# Altium schematic sheet secon_analog_in.SchDoc: foxBMS BMS-Slave 12-Cell
size A3; DocumentNumber: 10; SheetNumber: 10; SheetTotal: 19; AUTHOR: Fraunhofer IISB foxBMS Team; SheetDescription: Secondary Analog Inputs
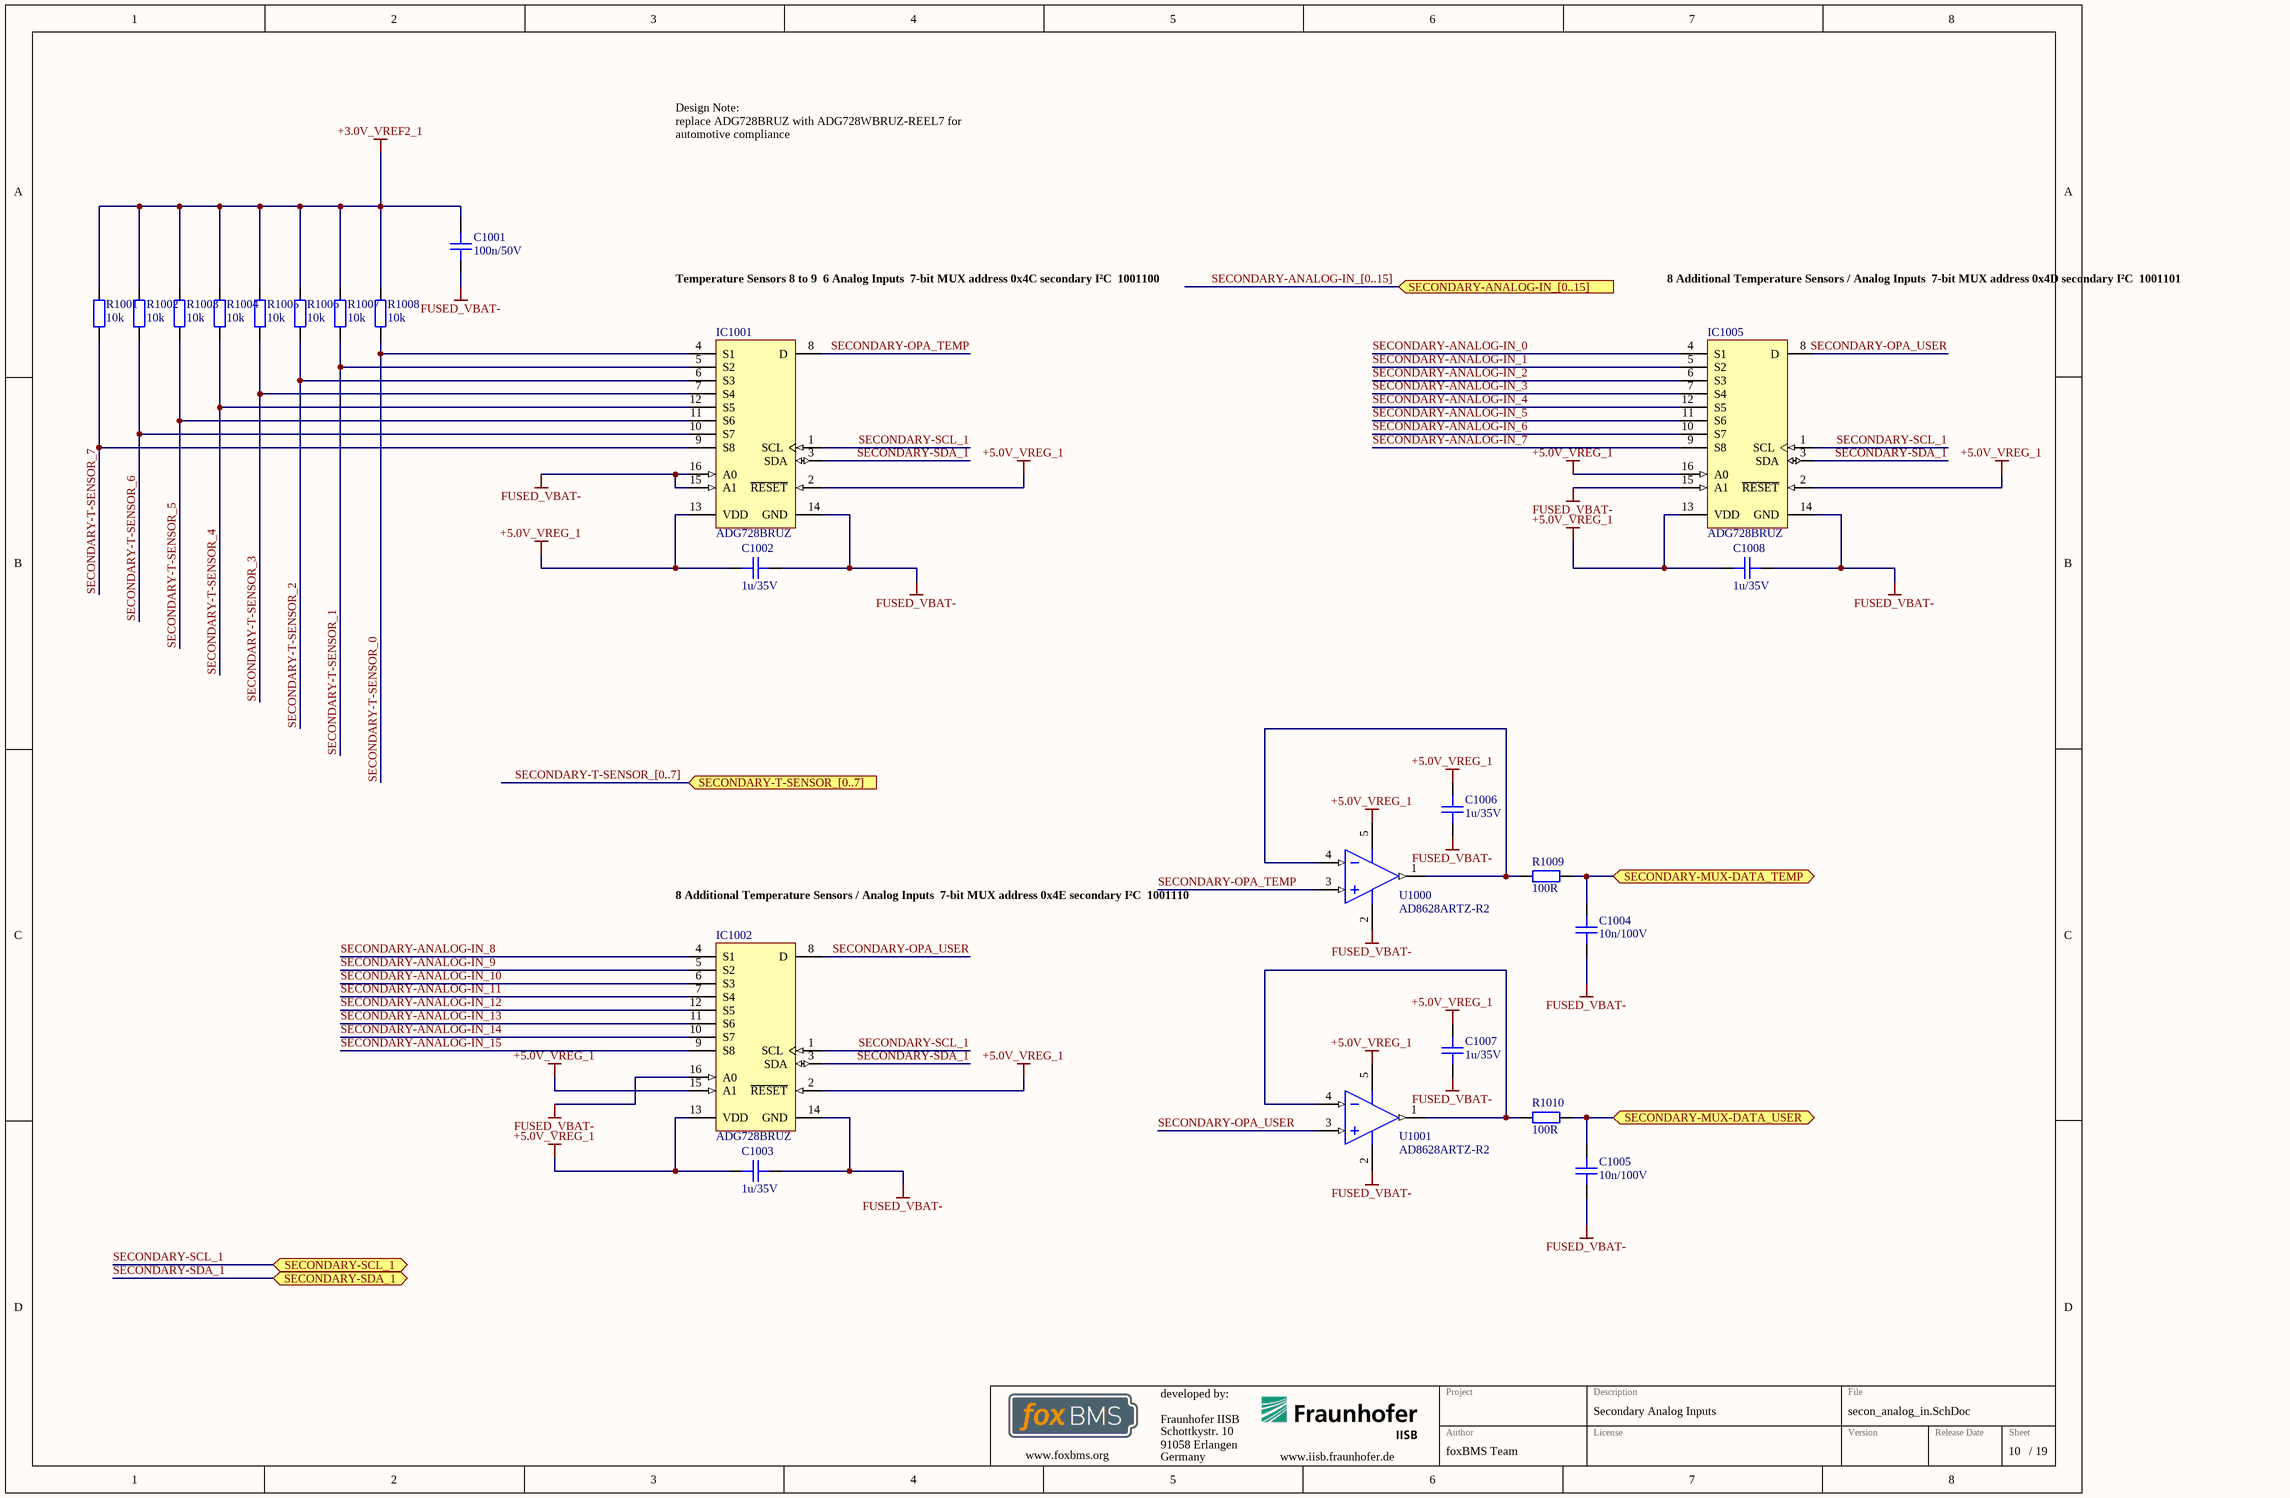
[diagram p0: secon_analog_in.SchDoc]

## Parts
C1001  100n/50V  [CAPC1608X08N]
C1002  1u/35V  [CAPC1608X08N]
C1003  1u/35V  [CAPC1608X08N]
C1004  10n/100V  [CAPC1608X08N]
C1005  10n/100V  [CAPC1608X08N]
C1006  1u/35V  [CAPC1608X08N]
C1007  1u/35V  [CAPC1608X08N]
C1008  1u/35V  [CAPC1608X08N]
IC1001  ADG728BRUZ  [ADI-RU-16_M]
IC1002  ADG728BRUZ  [ADI-RU-16_M]
IC1005  ADG728BRUZ  [ADI-RU-16_M]
R1001  10k  [RESC1608X05N]
R1002  10k  [RESC1608X05N]
R1003  10k  [RESC1608X05N]
R1004  10k  [RESC1608X05N]
R1005  10k  [RESC1608X05N]
R1006  10k  [RESC1608X05N]
R1007  10k  [RESC1608X05N]
R1008  10k  [RESC1608X05N]
R1009  100R  [RESC1608X05N]
R1010  100R  [RESC1608X05N]
U1000  AD8628ARTZ-R2  [ADI-RJ-5_M]
U1001  AD8628ARTZ-R2  [ADI-RJ-5_M]

## Ports
SECONDARY-ANALOG-IN_[0..15] (in), SECONDARY-MUX-DATA_TEMP (bidir), SECONDARY-MUX-DATA_USER (bidir), SECONDARY-SCL_1 (bidir), SECONDARY-SDA_1 (bidir), SECONDARY-T-SENSOR_[0..7] (in)

## Nets
+3.0V_VREF2_1: C1001.2 R1001.2 R1002.2 R1003.2 R1004.2 R1005.2 R1006.2 R1007.2 R1008.2
+5.0V_VREG_1: C1002.2 C1003.2 C1006.2 C1007.2 C1008.2 IC1001.2(~{RESET}) IC1001.13(VDD) IC1002.2(~{RESET}) IC1002.13(VDD) IC1002.15(A1) IC1005.2(~{RESET}) IC1005.13(VDD) IC1005.16(A0) U1000.5(+V) U1001.5(+V)
FUSED_VBAT-: C1001.1 C1002.1 C1003.1 C1004.1 C1005.1 C1006.1 C1007.1 C1008.1 IC1001.14(GND) IC1001.15(A1) IC1001.16(A0) IC1002.14(GND) IC1002.16(A0) IC1005.14(GND) IC1005.15(A1) U1000.2(-V) U1001.2(-V)
SECONDARY-ANALOG-IN_0: IC1005.4(S1)
SECONDARY-ANALOG-IN_1: IC1005.5(S2)
SECONDARY-ANALOG-IN_2: IC1005.6(S3)
SECONDARY-ANALOG-IN_3: IC1005.7(S4)
SECONDARY-ANALOG-IN_4: IC1005.12(S5)
SECONDARY-ANALOG-IN_5: IC1005.11(S6)
SECONDARY-ANALOG-IN_6: IC1005.10(S7)
SECONDARY-ANALOG-IN_7: IC1005.9(S8)
SECONDARY-ANALOG-IN_8: IC1002.4(S1)
SECONDARY-ANALOG-IN_9: IC1002.5(S2)
SECONDARY-ANALOG-IN_10: IC1002.6(S3)
SECONDARY-ANALOG-IN_11: IC1002.7(S4)
SECONDARY-ANALOG-IN_12: IC1002.12(S5)
SECONDARY-ANALOG-IN_13: IC1002.11(S6)
SECONDARY-ANALOG-IN_14: IC1002.10(S7)
SECONDARY-ANALOG-IN_15: IC1002.9(S8)
SECONDARY-MUX-DATA_TEMP: C1004.2 R1009.2 ; port SECONDARY-MUX-DATA_TEMP
SECONDARY-MUX-DATA_USER: C1005.2 R1010.2 ; port SECONDARY-MUX-DATA_USER
SECONDARY-OPA_TEMP: IC1001.8(D) U1000.3(+IN)
SECONDARY-OPA_USER: IC1002.8(D) IC1005.8(D) U1001.3(+IN)
SECONDARY-SCL_1: IC1001.1(SCL) IC1002.1(SCL) IC1005.1(SCL) ; port SECONDARY-SCL_1
SECONDARY-SDA_1: IC1001.3(SDA) IC1002.3(SDA) IC1005.3(SDA) ; port SECONDARY-SDA_1
SECONDARY-T-SENSOR_0: IC1001.4(S1) R1008.1
SECONDARY-T-SENSOR_1: IC1001.5(S2) R1007.1
SECONDARY-T-SENSOR_2: IC1001.6(S3) R1006.1
SECONDARY-T-SENSOR_3: IC1001.7(S4) R1005.1
SECONDARY-T-SENSOR_4: IC1001.12(S5) R1004.1
SECONDARY-T-SENSOR_5: IC1001.11(S6) R1003.1
SECONDARY-T-SENSOR_6: IC1001.10(S7) R1002.1
SECONDARY-T-SENSOR_7: IC1001.9(S8) R1001.1
NetR1009_1: R1009.1 U1000.1(OUT) U1000.4(-IN)
NetR1010_1: R1010.1 U1001.1(OUT) U1001.4(-IN)

## Buses and harness runs
bus SECONDARY-ANALOG-IN_[0..15] = port SECONDARY-ANALOG-IN_[0..15]
bus SECONDARY-T-SENSOR_[0..7] = port SECONDARY-T-SENSOR_[0..7]

## Notes on the sheet
- Design Note:
  replace ADG728BRUZ with ADG728WBRUZ-REEL7 for automotive compliance
- Temperature Sensors 8 to 9
  6 Analog Inputs
  7-bit MUX address 0x4C secondary I²C
  1001100
- 8 Additional Temperature Sensors / Analog Inputs
  7-bit MUX address 0x4D secondary I²C
  1001101
- 8 Additional Temperature Sensors / Analog Inputs
  7-bit MUX address 0x4E secondary I²C
  1001110
- Fraunhofer IISB
- Schottkystr. 10
- developed by:
- 91058 Erlangen
- Germany
- Author
- Project
- License
- Description
- File
- Version
- Release Date
- Sheet
- www.foxbms.org
- www.iisb.fraunhofer.de
- foxBMS Team
- /

## Library data of the parts
C1001 = gen_C_ceramic_100n_50V_X7R_0603: MLCC; Capacitance: 100n; Rated Voltage: 50V; Dielectric: X7R; Case EIA: 0603; Case Metric: 1608; PnP Package: C_0603_10; PnP Value: 100n/50V/X7R; PnP equipped: x; Automotive Qualified: False; Part Number: gen_C_ceramic_100n_50V_X7R_0603; Supplier 1: Farnell; Supplier Part Number 1: 2525267; Supplier 2: Digikey; Supplier Part Number 2: 490-6049-1-ND
C1002 C1003 C1006-C1008 = gen_C_ceramic_1u_35V_X7R_0603: MLCC; Capacitance: 1u; Rated Voltage: 35V; Dielectric: X7R; Case EIA: 0603; Case Metric: 1608; PnP Package: C_0603_10; PnP Value: 1uF/35V/X7R; PnP equipped: x; Automotive Qualified: False; Part Number: gen_C_ceramic_1u_35V_X7R_0603; Supplier 1: Farnell; Supplier Part Number 1: 1907508
C1004 C1005 = gen_C_ceramic_10n_100V_X7R_0603: MLCC; Capacitance: 10n; Rated Voltage: 100V; Dielectric: X7R; Case EIA: 0603; Case Metric: 1608; Automotive Qualified: False; Part Number: gen_C_ceramic_10n_100V_X7R_0603; Supplier 1: Farnell; Supplier Part Number 1: 1865545
IC1001 IC1002 IC1005 = CMP-0798-00197-1: CMOS, Low Voltage, 2-Wire Serially Controlled, Matrix Switch, -40 to 85 degC, 16-pin SOP (RU-16), Tube; Manufacturer: Analog Devices; Ron (ohms): 2.5; Supply V Guar Performance: Single_(+3V), Single_(+5V); Max Analog Signal Range: 0 to Vdd; Bandwidth (Hz): 65M; ComponentLink3Description: Package Specification; Packing: Tube; PartNumber: ADG728BRUZ; ComponentLink1URL: http://www.analog.com/en/index.html; Mounting Technology: Surface Mount; DatasheetVersion: Rev. C; ComponentLink1Description: Manufacturer URL; ComponentLink3URL: http:/www.analog.com/static/imported-files/packages/36244347913743854010197452789RU16.pdf; ComponentLink2URL: http://www.analog.com/static/imported-files/data_sheets/ADG728_729.pdf; PackageVersion: Nov-02; PackageDescription: 16-Pin Thin Shrink Small Outline Package, Body 5 x 4.4 mm, Pitch 0.65 mm; Code_JEDEC: MO-153AB; PackageReference: RU-16; ComponentLink2Description: Datasheet
R1001-R1008 = gen_R_10k_0603: SMD Resistor 10k 0603; Tolerance: 1%; Power: 0.1W; Case EIA: 0603; Case Metric: 1608; Maximum Working Voltage: 75V; PnP Package: R_0603; Automotive Qualified: False; Part Number: gen_R_10k_0603; Operating Temperature: -55°C - +155°C; Resistance: 10k; Series: E24, E96; PnP Value: 10k; Supplier 1: Farnell; Supplier Part Number 1: 2073349
R1009 R1010 = gen_R_100R_0603: SMD Resistor 100R 0603; Tolerance: 1%; Power: 0.1W; Case EIA: 0603; Case Metric: 1608; Maximum Working Voltage: 75V; PnP Package: R_0603; Automotive Qualified: False; Part Number: gen_R_100R_0603; Operating Temperature: -55°C - +155°C; Resistance: 100R; Series: E24, E96; PnP Value: 100R; Supplier 1: Farnell; Supplier Part Number 1: 1469752
U1000 U1001 = CMP-0384-01512-2: Single Channel RRIO Operational Amplifier, 2.5 MHz BW, 1 V/us SR, Industrial, 5-pin SOT23 (RJ-5), Reel; Manufacturer: Analog Devices; Generic Part Number: AD8628; Iq/Amp: 1.1mA; Automotive Qualified: Yes; V Span Max: 6V; Input Bias Current: 30pA; Slew Rate: 1V/us; Amplifiers Per Package: 1; Input Offset Voltage: 1uV; Small Signal Bandwidth: 2.5MHz; V Span Min: 2.7V; ComponentLink1Description: Manufacturer URL; DatasheetVersion: Rev. I; ComponentLink4Description: Reference Circuit; Code_JEDEC: MO-178-AA; PackageDescription: 5-Pin Small Outline Transistor Package, Body 2.9 x 1.6 mm, Pitch 0.95 mm; ComponentLink3URL: http://www.analog.com/static/imported-files/packages/PKG_PDF/SOT-23(RJ)/RJ_5.pdf; PackageReference: RJ-5; ComponentLink1URL: http://www.analog.com/en/index.html; PackageVersion: 121608-A; RevisionNote: Reference Circuit URL fixed; Mounting Technology: Surface Mount; ComponentLink2Description: Datasheet; ComponentLink3Description: Package Specification; ComponentLink4URL: http://www.analog.com/en/all-operational-amplifiers-op-amps/operational-amplifiers-op-amps/ad8628/products/product.html#product-recommendations; ComponentLink2URL: http://www.analog.com/static/imported-files/data_sheets/AD8628_8629_8630.pdf; PartNumber: AD8628ARTZ-R2